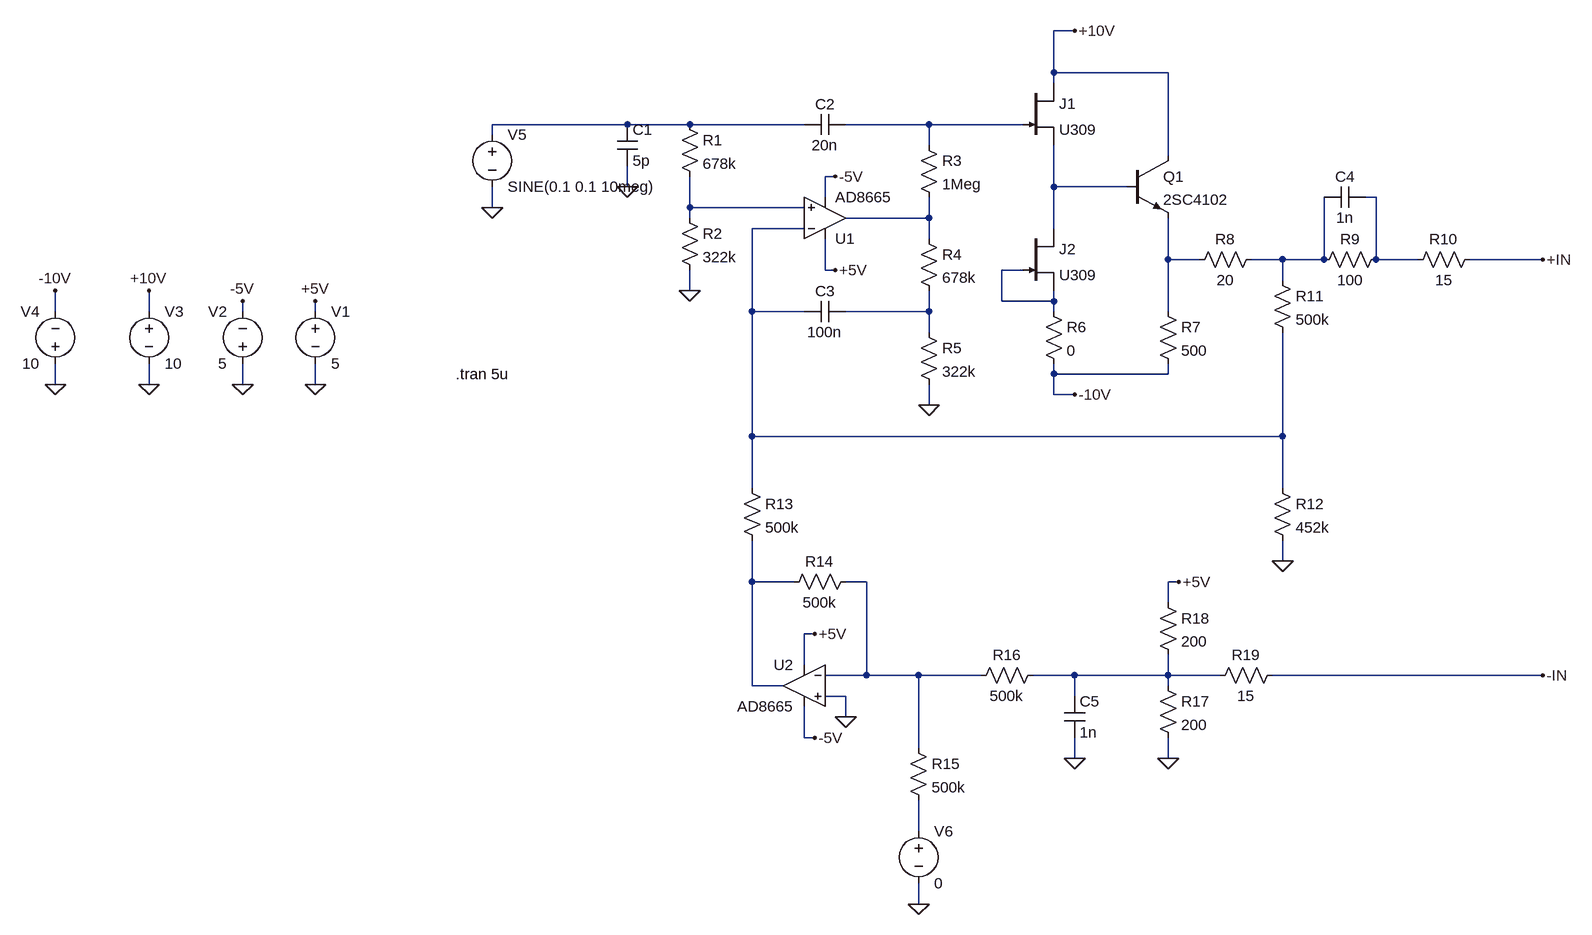
[diagram p0: schematic PGA_JFET_BUFFER.asc]
PGA_JFET_BUFFER.asc, the LTspice schematic file:
Version 4
SHEET 1 1512 1348
WIRE 736 -16 704 -16
WIRE 704 48 704 -16
WIRE 880 48 704 48
WIRE 704 64 704 48
WIRE 48 128 -160 128
WIRE 144 128 48 128
WIRE 320 128 144 128
WIRE 512 128 384 128
WIRE 656 128 512 128
WIRE -160 144 -160 128
WIRE 512 160 512 128
WIRE 880 176 880 48
WIRE 368 208 352 208
WIRE 48 224 48 192
WIRE 704 224 704 160
WIRE 816 224 704 224
WIRE 352 240 352 208
WIRE 1200 240 1184 240
WIRE -160 256 -160 224
WIRE 144 256 144 208
WIRE 320 256 144 256
WIRE 144 272 144 256
WIRE 512 272 512 240
WIRE 512 272 384 272
WIRE 320 288 240 288
WIRE 704 288 704 224
WIRE 512 304 512 272
WIRE 880 336 880 272
WIRE 928 336 880 336
WIRE 1056 336 1008 336
WIRE 1120 336 1120 240
WIRE 1120 336 1056 336
WIRE 1200 336 1200 240
WIRE 1264 336 1200 336
WIRE 1456 336 1344 336
WIRE 352 352 352 304
WIRE 368 352 352 352
WIRE 656 352 624 352
WIRE 1056 368 1056 336
WIRE 144 384 144 352
WIRE 624 400 624 352
WIRE 704 400 704 384
WIRE 704 400 624 400
WIRE -832 416 -832 384
WIRE -688 416 -688 384
WIRE -544 416 -544 400
WIRE -432 416 -432 400
WIRE 240 416 240 288
WIRE 320 416 240 416
WIRE 512 416 512 384
WIRE 512 416 384 416
WIRE 704 416 704 400
WIRE 880 416 880 336
WIRE 512 448 512 416
WIRE 704 512 704 496
WIRE 880 512 880 496
WIRE 880 512 704 512
WIRE -832 528 -832 496
WIRE -688 528 -688 496
WIRE -544 528 -544 496
WIRE -432 528 -432 496
WIRE 704 544 704 512
WIRE 736 544 704 544
WIRE 512 560 512 528
WIRE 240 608 240 416
WIRE 1056 608 1056 448
WIRE 1056 608 240 608
WIRE 240 688 240 608
WIRE 1056 688 1056 608
WIRE 1056 800 1056 768
WIRE 240 832 240 768
WIRE 304 832 240 832
WIRE 416 832 384 832
WIRE 896 832 880 832
WIRE 880 864 880 832
WIRE 336 912 320 912
WIRE 320 960 320 912
WIRE 416 976 416 832
WIRE 416 976 352 976
WIRE 496 976 416 976
WIRE 592 976 496 976
WIRE 736 976 672 976
WIRE 880 976 880 944
WIRE 880 976 736 976
WIRE 960 976 880 976
WIRE 1456 976 1040 976
WIRE 240 992 240 832
WIRE 288 992 240 992
WIRE 880 992 880 976
WIRE 384 1008 352 1008
WIRE 736 1008 736 976
WIRE 384 1040 384 1008
WIRE 320 1072 320 1024
WIRE 336 1072 320 1072
WIRE 496 1088 496 976
WIRE 736 1104 736 1072
WIRE 880 1104 880 1072
WIRE 496 1216 496 1168
WIRE 496 1328 496 1296
FLAG 144 384 0
FLAG 48 224 0
FLAG 368 208 -5V
FLAG 368 352 +5V
FLAG 512 560 0
FLAG 736 -16 +10V
FLAG 736 544 -10V
FLAG 1056 800 0
FLAG 384 1040 0
FLAG 336 912 +5V
FLAG 336 1072 -5V
FLAG 496 1328 0
FLAG 736 1104 0
FLAG 880 1104 0
FLAG 896 832 +5V
FLAG 1456 336 +IN
FLAG 1456 976 -IN
FLAG -832 528 0
FLAG -688 528 0
FLAG -544 528 0
FLAG -432 528 0
FLAG -544 400 -5V
FLAG -432 400 +5V
FLAG -688 384 +10V
FLAG -832 384 -10V
FLAG -160 256 0
SYMBOL cap 32 128 R0
SYMATTR InstName C1
SYMATTR Value 5p
SYMBOL res 128 112 R0
SYMATTR InstName R1
SYMATTR Value 678k
SYMBOL res 128 256 R0
SYMATTR InstName R2
SYMATTR Value 322k
SYMBOL cap 320 112 M90
WINDOW 0 0 32 VBottom 2
WINDOW 3 32 32 VTop 2
SYMATTR InstName C2
SYMATTR Value 20n
SYMBOL Opamps\\AD8665 352 336 M180
SYMATTR InstName U1
SYMBOL res 496 144 R0
SYMATTR InstName R3
SYMATTR Value 1Meg
SYMBOL res 496 288 R0
SYMATTR InstName R4
SYMATTR Value 678k
SYMBOL res 496 432 R0
SYMATTR InstName R5
SYMATTR Value 322k
SYMBOL cap 384 400 R90
WINDOW 0 0 32 VBottom 2
WINDOW 3 32 32 VTop 2
SYMATTR InstName C3
SYMATTR Value 100n
SYMBOL njf 656 64 R0
SYMATTR InstName J1
SYMATTR Value U309
SYMBOL njf 656 288 R0
SYMATTR InstName J2
SYMATTR Value U309
SYMBOL res 688 400 R0
SYMATTR InstName R6
SYMATTR Value 0
SYMBOL npn 816 176 R0
SYMATTR InstName Q1
SYMATTR Value 2SC4102
SYMBOL res 864 400 R0
SYMATTR InstName R7
SYMATTR Value 500
SYMBOL res 1024 320 R90
WINDOW 0 0 56 VBottom 2
WINDOW 3 32 56 VTop 2
SYMATTR InstName R8
SYMATTR Value 20
SYMBOL res 1216 320 R90
WINDOW 0 0 56 VBottom 2
WINDOW 3 32 56 VTop 2
SYMATTR InstName R9
SYMATTR Value 100
SYMBOL cap 1184 224 R90
WINDOW 0 0 32 VBottom 2
WINDOW 3 32 32 VTop 2
SYMATTR InstName C4
SYMATTR Value 1n
SYMBOL res 1360 320 R90
WINDOW 0 0 56 VBottom 2
WINDOW 3 32 56 VTop 2
SYMATTR InstName R10
SYMATTR Value 15
SYMBOL res 1040 352 R0
SYMATTR InstName R11
SYMATTR Value 500k
SYMBOL res 1040 672 R0
SYMATTR InstName R12
SYMATTR Value 452k
SYMBOL Opamps\\AD8665 320 928 M0
SYMATTR InstName U2
SYMBOL res 224 672 R0
SYMATTR InstName R13
SYMATTR Value 500k
SYMBOL res 400 816 R90
WINDOW 0 0 56 VBottom 2
WINDOW 3 32 56 VTop 2
SYMATTR InstName R14
SYMATTR Value 500k
SYMBOL res 480 1072 R0
SYMATTR InstName R15
SYMATTR Value 500k
SYMBOL res 688 960 R90
WINDOW 0 0 56 VBottom 2
WINDOW 3 32 56 VTop 2
SYMATTR InstName R16
SYMATTR Value 500k
SYMBOL cap 720 1008 R0
SYMATTR InstName C5
SYMATTR Value 1n
SYMBOL res 864 976 R0
SYMATTR InstName R17
SYMATTR Value 200
SYMBOL res 864 848 R0
SYMATTR InstName R18
SYMATTR Value 200
SYMBOL res 1056 960 R90
WINDOW 0 0 56 VBottom 2
WINDOW 3 32 56 VTop 2
SYMATTR InstName R19
SYMATTR Value 15
SYMBOL voltage -432 400 R0
WINDOW 123 0 0 Left 0
WINDOW 39 0 0 Left 0
SYMATTR InstName V1
SYMATTR Value 5
SYMBOL voltage -544 512 R180
WINDOW 0 24 96 Left 2
WINDOW 3 24 16 Left 2
WINDOW 123 0 0 Left 0
WINDOW 39 0 0 Left 0
SYMATTR InstName V2
SYMATTR Value 5
SYMBOL voltage -688 400 R0
WINDOW 123 0 0 Left 0
WINDOW 39 0 0 Left 0
SYMATTR InstName V3
SYMATTR Value 10
SYMBOL voltage -832 512 R180
WINDOW 0 24 96 Left 2
WINDOW 3 24 16 Left 2
WINDOW 123 0 0 Left 0
WINDOW 39 0 0 Left 0
SYMATTR InstName V4
SYMATTR Value 10
SYMBOL voltage -160 128 R0
WINDOW 123 0 0 Left 0
WINDOW 39 0 0 Left 0
SYMATTR InstName V5
SYMATTR Value SINE(0.1 0.1 10meg)
SYMBOL voltage 496 1200 R0
WINDOW 123 0 0 Left 0
WINDOW 39 0 0 Left 0
SYMATTR InstName V6
SYMATTR Value 0
TEXT -216 512 Left 2 !.tran 5u

The netlist it stands for:
* PGA_JFET_BUFFER.asc
C1 N001 0 5p
R1 N001 N005 678k
R2 N005 0 322k
C2 N001 N002 20n
XU1 N005 N007 +5V -5V N006 AD8665  ; pins In+ In- V+ V- OUT
R3 N002 N006 1Meg
R4 N006 N011 678k
R5 N011 0 322k
C3 N011 N007 100n
J1 +10V N002 N003 U309
J2 N003 N010 N010 U309
R6 N010 -10V 0
Q1 +10V N003 N008 0 2SC4102
R7 N008 -10V 500
R8 N009 N008 20
R9 N004 N009 100
C4 N004 N009 1n
R10 +IN N004 15
R11 N009 N007 500k
R12 N007 0 452k
XU2 0 N013 +5V -5V N012 AD8665  ; pins In+ In- V+ V- OUT
R13 N007 N012 500k
R14 N013 N012 500k
R15 N013 N015 500k
R16 N014 N013 500k
C5 N014 0 1n
R17 N014 0 200
R18 +5V N014 200
R19 -IN N014 15
V1 +5V 0 5
V2 0 -5V 5
V3 +10V 0 10
V4 0 -10V 10
V5 N001 0 SINE(0.1 0.1 10meg)
V6 N015 0 0
.model NPN NPN
.model PNP PNP
.lib standard.bjt
.model NJF NJF
.model PJF PJF
.lib standard.jft
.tran 5u
.backanno
.end